# EAGLE design rapidshark-lipo-charger-mk-1.0 (EAGLE 7.5.0)
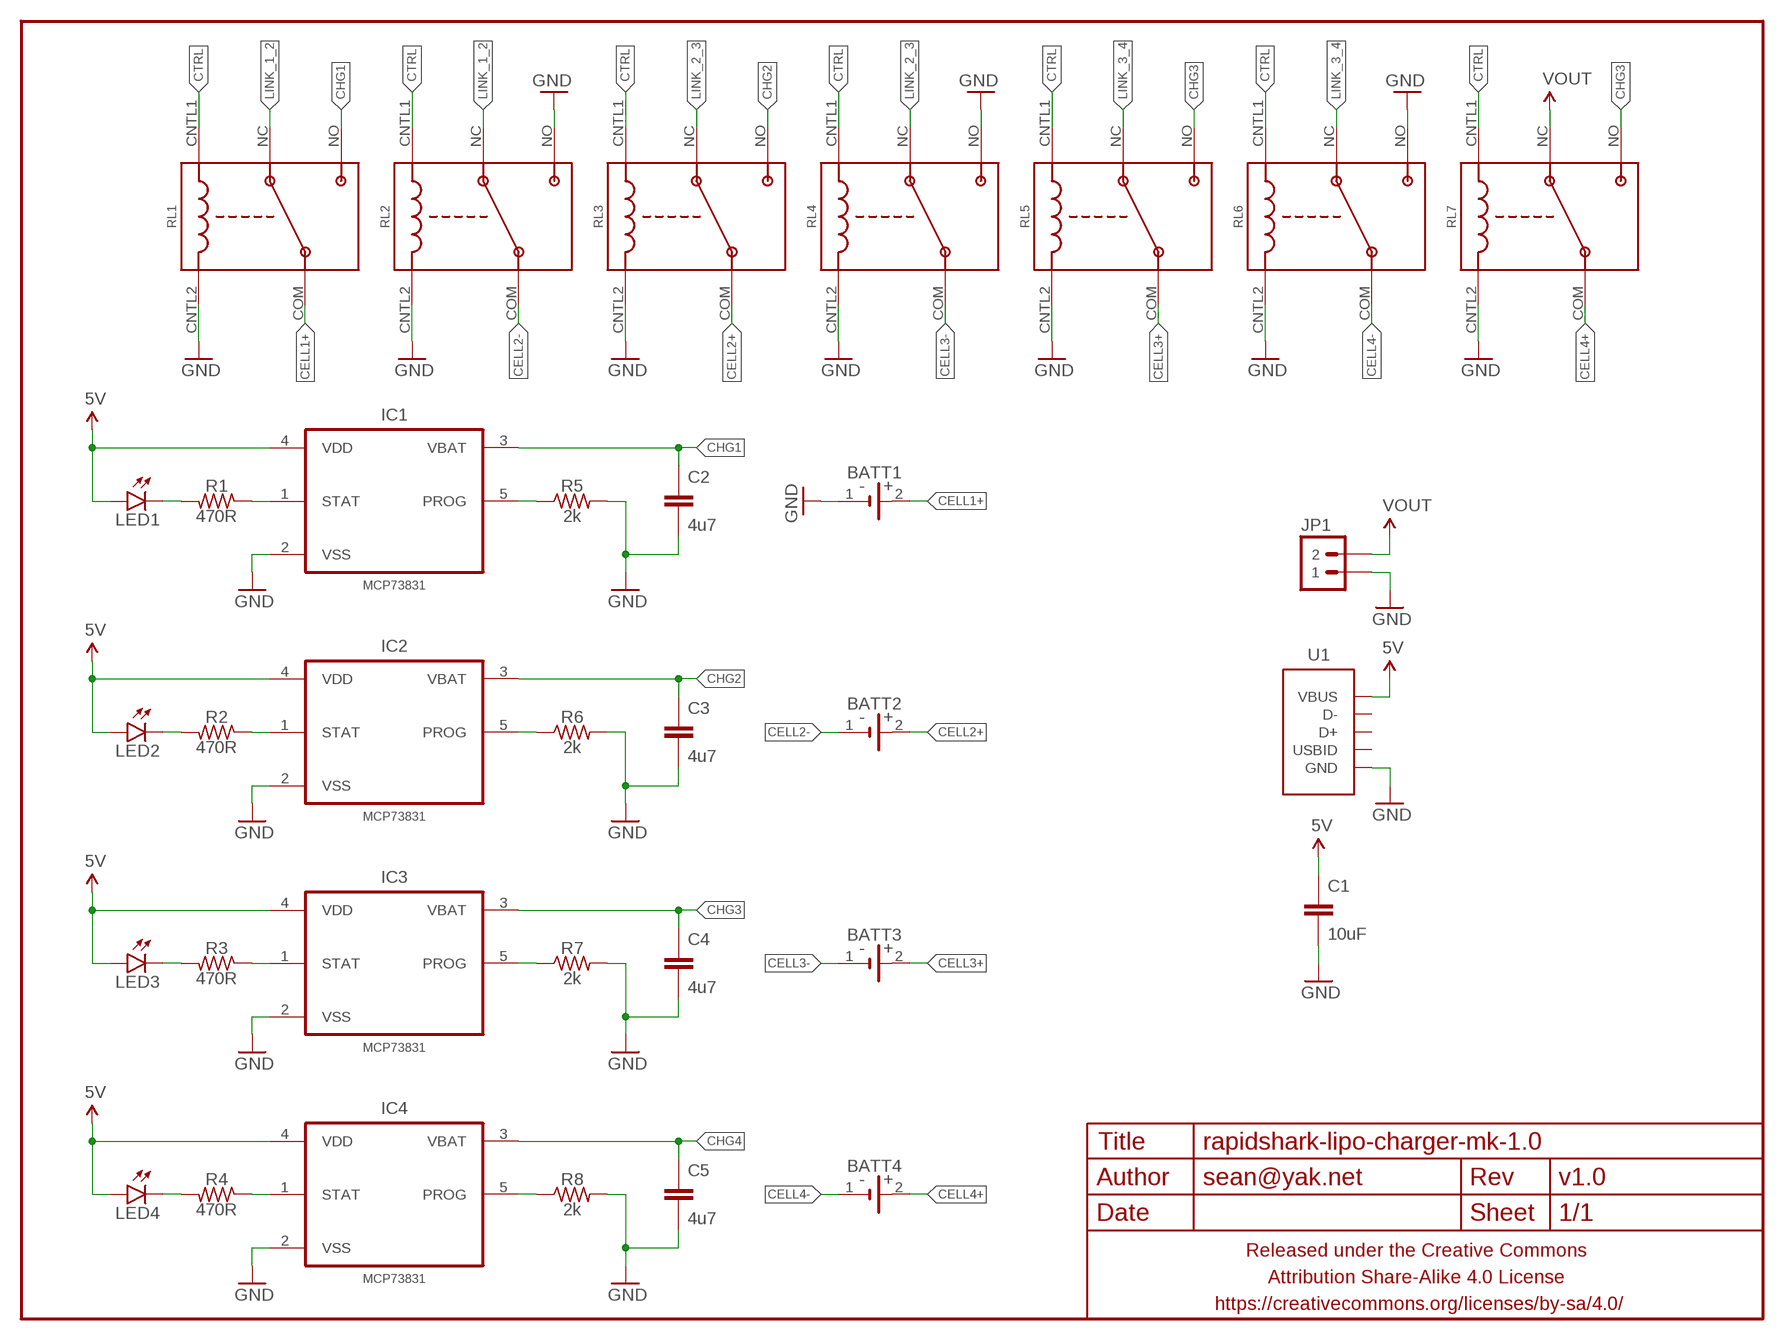
[diagram p0: schematic, sheet 1]

## Parts
BATT1  LIPO1S_3.7V_EXT0.1IN_PTH  [1X02-CENTER-R+]
BATT2  LIPO1S_3.7V_EXT0.1IN_PTH  [1X02-CENTER-R+]
BATT3  LIPO1S_3.7V_EXT0.1IN_PTH  [1X02-CENTER-R+]
BATT4  LIPO1S_3.7V_EXT0.1IN_PTH  [1X02-CENTER-R+]
C1  10uF  CAPACITOR-CERAMICC0805  [C0805]
C2  4u7  CAPACITOR-CERAMICC0805  [C0805]
C3  4u7  CAPACITOR-CERAMICC0805  [C0805]
C4  4u7  CAPACITOR-CERAMICC0805  [C0805]
C5  4u7  CAPACITOR-CERAMICC0805  [C0805]
FRAME1  FRAME-LETTERNO_PACKAGE  [DUMMY]
IC1  MCP73831  MCP73831T-2ACI/OT  [SOT95P280X145-5N]
IC2  MCP73831  MCP73831T-2ACI/OT  [SOT95P280X145-5N]
IC3  MCP73831  MCP73831T-2ACI/OT  [SOT95P280X145-5N]
IC4  MCP73831  MCP73831T-2ACI/OT  [SOT95P280X145-5N]
JP1  M025MM  [SCREWTERMINAL-5MM-2]
LED1  LED0805  [LED-0805]
LED2  LED0805  [LED-0805]
LED3  LED0805  [LED-0805]
LED4  LED0805  [LED-0805]
R1  470R  RESISTORR0805  [R0805]
R2  470R  RESISTORR0805  [R0805]
R3  470R  RESISTORR0805  [R0805]
R4  470R  RESISTORR0805  [R0805]
R5  2k  RESISTORR0805  [R0805]
R6  2k  RESISTORR0805  [R0805]
R7  2k  RESISTORR0805  [R0805]
R8  2k  RESISTORR0805  [R0805]
RL1  RELAY-SPDTMC25131  [RELAY-SPDT-MC25131]
RL2  RELAY-SPDTMC25131  [RELAY-SPDT-MC25131]
RL3  RELAY-SPDTMC25131  [RELAY-SPDT-MC25131]
RL4  RELAY-SPDTMC25131  [RELAY-SPDT-MC25131]
RL5  RELAY-SPDTMC25131  [RELAY-SPDT-MC25131]
RL6  RELAY-SPDTMC25131  [RELAY-SPDT-MC25131]
RL7  RELAY-SPDTMC25131  [RELAY-SPDT-MC25131]
U1  USB-ABFCI-10103594-USB-MICRO-B-LESS  [FCI-10103594-USB-MICRO-B-LESS]

## Nets
5V: C1.1 IC1.4(VDD) IC2.4(VDD) IC3.4(VDD) IC4.4(VDD) LED1.A LED2.A LED3.A LED4.A U1.1(VBUS)
CELL1+: BATT1.2(+) RL1.COM
CELL2+: BATT2.2(+) RL3.COM
CELL2-: BATT2.1(-) RL2.COM
CELL3+: BATT3.2(+) RL5.COM
CELL3-: BATT3.1(-) RL4.COM
CELL4+: BATT4.2(+) RL7.COM
CELL4-: BATT4.1(-) RL6.COM
CHG1: C2.1 IC1.3(VBAT) RL1.NO
CHG2: C3.1 IC2.3(VBAT) RL3.NO
CHG3: C4.1 IC3.3(VBAT) RL5.NO RL7.NO
CHG4: C5.1 IC4.3(VBAT)
CTRL: RL1.CNTL1(C$1) RL2.CNTL1(C$1) RL3.CNTL1(C$1) RL4.CNTL1(C$1) RL5.CNTL1(C$1) RL6.CNTL1(C$1) RL7.CNTL1(C$1)
GND: BATT1.1(-) C1.2 C2.2 C3.2 C4.2 C5.2 IC1.2(VSS) IC2.2(VSS) IC3.2(VSS) IC4.2(VSS) JP1.1 R5.2 R6.2 R7.2 R8.2 RL1.CNTL2(C$2) RL2.CNTL2(C$2) RL2.NO RL3.CNTL2(C$2) RL4.CNTL2(C$2) RL4.NO RL5.CNTL2(C$2) RL6.CNTL2(C$2) RL6.NO RL7.CNTL2(C$2) U1.5(GND)
LINK_1_2: RL1.NC RL2.NC
LINK_2_3: RL3.NC RL4.NC
LINK_3_4: RL5.NC RL6.NC
N$1: LED1.C R1.2
N$2: IC1.1(STAT) R1.1
N$3: LED2.C R2.2
N$4: LED3.C R3.2
N$5: LED4.C R4.2
N$6: IC2.1(STAT) R2.1
N$7: IC3.1(STAT) R3.1
N$8: IC4.1(STAT) R4.1
N$9: IC1.5(PROG) R5.1
N$10: IC2.5(PROG) R6.1
N$11: IC3.5(PROG) R7.1
N$12: IC4.5(PROG) R8.1
VOUT: JP1.2 RL7.NC
Unconnected: U1.2(D-) U1.3(D+) U1.4(USBID)

## Library data of the parts
BATT1-BATT4 = a_parts:LIPO1S_3.7V_EXT: NC ACCU Varta Mempac S 1V2 - 2V4
C1-C5 = a_parts:CAPACITOR-CERAMIC: CAPACITOR, European symbol
FRAME1 = A_butts:FRAME-LETTER: Schematic Frame Standard 8.5x11 US Letter frame; DESIGNER: sean@yak.net; VERSION: v1.0
IC1-IC4 = a_parts:MCP73831T-2ACI/OT: Charge Management Controller; MPN: MCP73831T-2ACI/OT; OC_FARNELL: 1332158; OC_NEWARK: 56K7045; PACKAGE: SOT-5; SUPPLIER: Microchip
JP1 = a_parts:M02: Standard 2-pin 0.1" header. Use with - straight break away headers ( PRT-00116) - right angle break away headers (PRT-00553) - swiss pins (PRT-00743) - machine pins (PRT-00117) - female headers (PRT-00115) Molex polarized connector foot print use with: PRT-08233 with associated crimp pins and housings. 2.54_SCREWTERM for use with PRT-10571. 3.5mm Screw Terminal footprints for PRT-08084 5mm Screw Terminal footprints for use with PRT-08433
LED1-LED4 = a_parts:LED: LEDs Standard schematic elements and footprints for 5mm, 3mm, 1206, and 0603 sized LEDs. 5mm - Spark Fun Electronics SKU : COM-00529 (and others)
R1-R8 = a_parts:RESISTOR: RESISTOR, American symbol
RL1-RL7 = a_parts:RELAY-SPDT
U1 = a_parts:USB-AB: This is a USB AB connector that is compatible with USB OTG. i.e. this connector can serve as a host or device

## Board
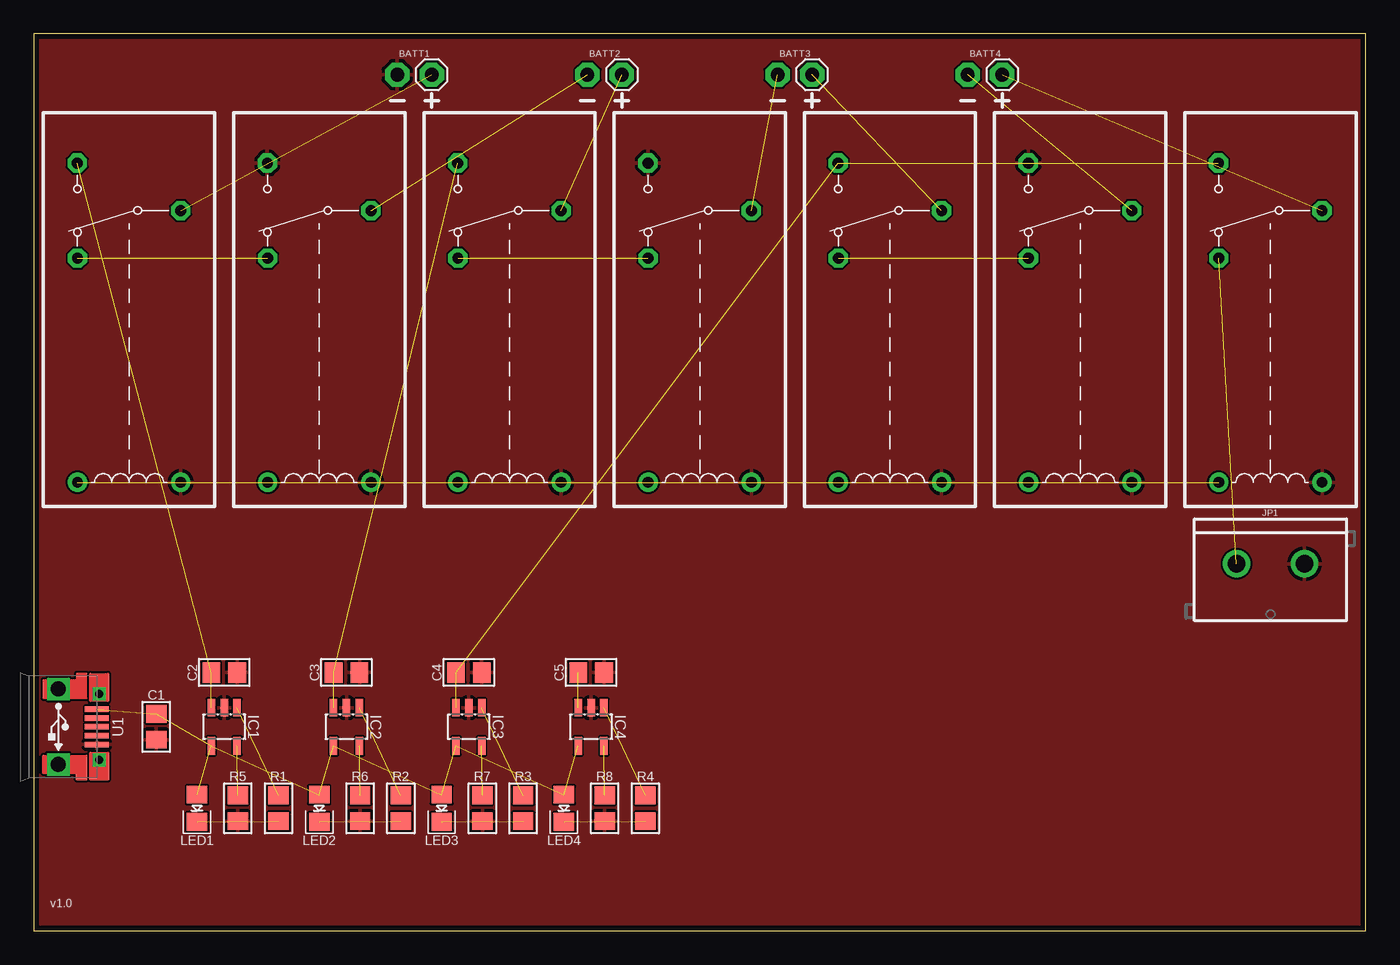
[diagram p1: board, top side]

Size 98 x 66 mm. Coordinates in mm from the lower left corner, seen from the top.
Outline: 98,0 98,66 0,66 0,0 98,0
Copper layers (1*16): Top 0.0356mm / dielectric 1.5011mm / Bottom 0.0356mm
Design rules "LaenPCBOrder_2": minimum track width 6mil, minimum drill 13mil, track to track 6mil, track to pad 6mil, pad to pad 6mil, via to via 6mil, smd to smd 6mil, copper to edge 15mil, drill to drill 6mil, minimum pad ring 7mil, minimum via ring 7mil, stop-mask expansion 3mil, vias tented up to drill 20mil, thermal gap 10mil

### Footprints (pad centres in the part's own frame; a part is rotated, then mirrored left to right if it is on the bottom)
1X02-CENTER-R+ = drill 1 pad 1.8 octagon: 1 -1.27,0; 2 1.27,0
C0805 = smd 1.3 x 1.5: 1 -0.95,0; 2 0.95,0
SOT95P280X145-5N = smd 1.3 x 0.55: 1 -1.4,0.95; 2 -1.4,0; 3 -1.4,-0.95; 4 1.4,-0.95; 5 1.4,0.95
SCREWTERMINAL-5MM-2 = drill 1.3 pad 2.032: 1 -2.5,0; 2 2.5,0
LED-0805 = smd 1.5 x 1.3: A 0,-1; C 0,1
R0805 = smd 1.3 x 1.5: 1 -0.95,0; 2 0.95,0
RELAY-SPDT-MC25131 = drill 0.8 pad 1.422: CNTL1 0,3.8; CNTL2 0,-3.8 | drill 0.8 pad 1.422 octagon: COM 20,-3.8; NC 16.5,3.8; NO 23.5,3.82
FCI-10103594-USB-MICRO-B-LESS = smd 0.4 x 1.75: 1 -1.3,2.825; 2 -0.65,2.825; 3 0,2.825; 4 0.65,2.825; 5 1.3,2.825 | drill 0.6 square: SHIELD@1 -2.425,3; SHIELD@2 2.425,3 | drill 1.1 pad 1.3 square: SHIELD@3 -2.775,0; SHIELD@4 2.775,0

### Placement (x,y rotation side)
BATT1  28,63 0 top
BATT2  42,63 0 top
BATT3  56,63 0 top
BATT4  70,63 0 top
C1  9,15 270 top
C2  14,19 0 top
C3  23,19 0 top
C4  32,19 0 top
C5  41,19 0 top
FRAME1  0,0 0 top
IC1  14,15 270 top
IC2  23,15 270 top
IC3  32,15 270 top
IC4  41,15 270 top
JP1  91,27 180 top
LED1  12,9 180 top
LED2  21,9 180 top
LED3  30,9 180 top
LED4  39,9 180 top
R1  18,9 270 top
R2  27,9 270 top
R3  36,9 270 top
R4  45,9 270 top
R5  15,9 270 top
R6  24,9 270 top
R7  33,9 270 top
R8  42,9 270 top
RL1  7,33 90 top
RL2  21,33 90 top
RL3  35,33 90 top
RL4  49,33 90 top
RL5  63,33 90 top
RL6  77,33 90 top
RL7  91,33 90 top
U1  1.8,15 270 top

### Tracks (layer width: path | path; a pad name or v marks a point on that pad's centre or on a via)
5V  (9 unrouted)
CELL1+  (1 unrouted)
CELL2+  (1 unrouted)
CELL2-  (1 unrouted)
CELL3+  (1 unrouted)
CELL3-  (1 unrouted)
CELL4+  (1 unrouted)
CELL4-  (1 unrouted)
CHG1  (2 unrouted)
CHG2  (2 unrouted)
CHG3  (3 unrouted)
CHG4  (1 unrouted)
CTRL  (6 unrouted)
GND
  pour Top: 0,66 98,66 98,0 0,0
LINK_1_2  (1 unrouted)
LINK_2_3  (1 unrouted)
LINK_3_4  (1 unrouted)
N$1  (1 unrouted)
N$2  (1 unrouted)
N$3  (1 unrouted)
N$4  (1 unrouted)
N$5  (1 unrouted)
N$6  (1 unrouted)
N$7  (1 unrouted)
N$8  (1 unrouted)
N$9  (1 unrouted)
N$10  (1 unrouted)
N$11  (1 unrouted)
N$12  (1 unrouted)
VOUT  (1 unrouted)